# EAGLE design Impedance_Potential (EAGLE 9.6.2)
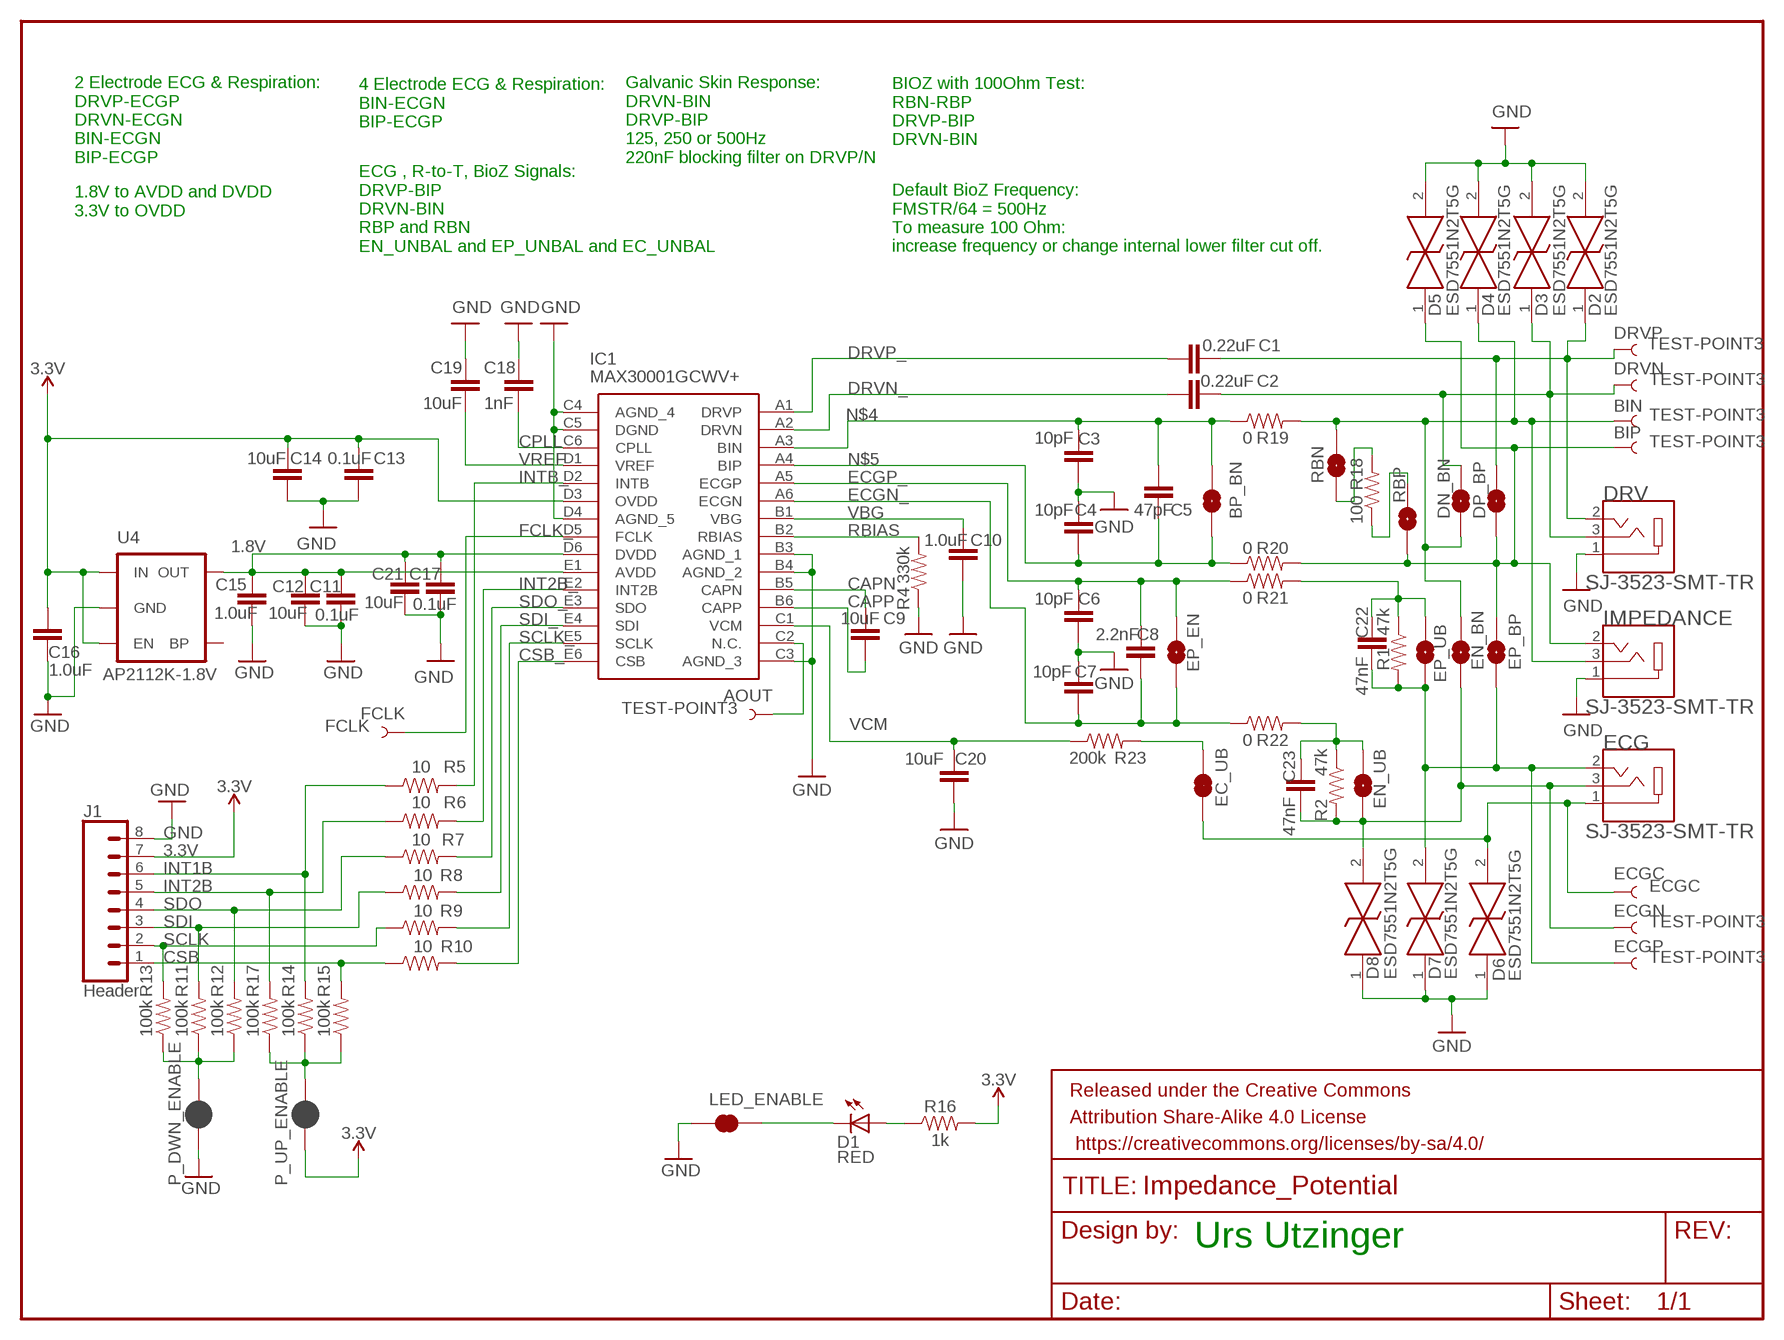
[diagram p0: schematic, sheet 1]

## Parts
AOUT  TEST-POINT3  [PAD.03X.03]
BIN  TEST-POINT3  [PAD.03X.03]
BIP  TEST-POINT3  [PAD.03X.03]
BP_BN  JUMPER-SMT_2_NO_SILK  [SMT-JUMPER_2_NO_SILK]
C1  0.22uF  0.22UF-0603-25V-10%  [0603]
C2  0.22uF  0.22UF-0603-25V-10%  [0603]
C3  10pF  10PF-0603-50V-5%  [0603]
C4  10pF  10PF-0603-50V-5%  [0603]
C5  47pF  47PF-0603-50V-5%  [0603]
C6  10pF  10PF-0603-50V-5%  [0603]
C7  10pF  10PF-0603-50V-5%  [0603]
C8  2.2nF  2.2NF/2200PF-0603-50V-10%  [0603]
C9  10uF  10UF-0603-6.3V-20%  [0603]
C10  1.0uF  1.0UF-0603-16V-10%  [0603]
C11  0.1uF  0.1UF-0603-25V-(+80/-20%)  [0603]
C12  10uF  10UF-0603-6.3V-20%  [0603]
C13  0.1uF  0.1UF-0603-25V-(+80/-20%)  [0603]
C14  10uF  10UF-0603-6.3V-20%  [0603]
C15  1.0uF  1.0UF-0603-16V-10%  [0603]
C16  1.0uF  1.0UF-0603-16V-10%  [0603]
C17  0.1uF  0.1UF-0603-25V-(+80/-20%)  [0603]
C18  1nF  1.0NF/1000PF-0603-50V-10%  [0603]
C19  10uF  10UF-0603-6.3V-20%  [0603]
C20  10uF  10UF-0603-6.3V-20%  [0603]
C21  10uF  10UF-0603-6.3V-20%  [0603]
C22  47nF  47NF-0603-25V-5%  [0603]
C23  47nF  47NF-0603-25V-5%  [0603]
D1  RED  LED-RED0603  [LED-0603]
D2  ESD7551N2T5G  [ESD7551N2T5G]
D3  ESD7551N2T5G  [ESD7551N2T5G]
D4  ESD7551N2T5G  [ESD7551N2T5G]
D5  ESD7551N2T5G  [ESD7551N2T5G]
D6  ESD7551N2T5G  [ESD7551N2T5G]
D7  ESD7551N2T5G  [ESD7551N2T5G]
D8  ESD7551N2T5G  [ESD7551N2T5G]
DN_BN  JUMPER-SMT_2_NO_SILK  [SMT-JUMPER_2_NO_SILK]
DP_BP  JUMPER-SMT_2_NO_SILK  [SMT-JUMPER_2_NO_SILK]
DRV  SJ-3523-SMT-TR  [CUI_SJ-3523-SMT-TR]
DRVN  TEST-POINT3  [PAD.03X.03]
DRVP  TEST-POINT3  [PAD.03X.03]
EC_UB  JUMPER-SMT_2_NC_TRACE_SILK  [SMT-JUMPER_2_NC_TRACE_SILK]
ECG  SJ-3523-SMT-TR  [CUI_SJ-3523-SMT-TR]
ECGC  ECGC  TEST-POINT3  [PAD.03X.03]
ECGN  TEST-POINT3  [PAD.03X.03]
ECGP  TEST-POINT3  [PAD.03X.03]
EN_BN  JUMPER-SMT_2_NO_SILK  [SMT-JUMPER_2_NO_SILK]
EN_UB  JUMPER-SMT_2_NO_SILK  [SMT-JUMPER_2_NO_SILK]
EP_BP  JUMPER-SMT_2_NO_SILK  [SMT-JUMPER_2_NO_SILK]
EP_EN  JUMPER-SMT_2_NO_SILK  [SMT-JUMPER_2_NO_SILK]
EP_UB  JUMPER-SMT_2_NO_SILK  [SMT-JUMPER_2_NO_SILK]
FCLK  FCLK  TEST-POINT3  [PAD.03X.03]
FRAME1  FRAME-LETTERNO_PACKAGE  [DUMMY]
IC1  MAX30001GCWV+  [BGA30C50P6X5_293X274X69]
IMPEDANCE  SJ-3523-SMT-TR  [CUI_SJ-3523-SMT-TR]
J1  Header  CONN_08"  [1X08]
LED_ENABLE  LED ENABLE  JUMPER-SMT_2_NC_TRACE_SILK  [SMT-JUMPER_2_NC_TRACE_SILK]
P_DWN_ENABLE  JUMPER-SMT_2_NC_PASTE_SILK  [SMT-JUMPER_2_NC_PASTE_SILK]
P_UP_ENABLE  JUMPER-SMT_2_NC_PASTE_SILK  [SMT-JUMPER_2_NC_PASTE_SILK]
R1  47k  47KOHM-0603-1/10W-1%  [0603]
R2  47k  47KOHM-0603-1/10W-1%  [0603]
R4  330k  330KOHM-0603-1/10W-1%  [0603]
R5  10  10OHM-0603-1/10W-1%  [0603]
R6  10  10OHM-0603-1/10W-1%  [0603]
R7  10  10OHM-0603-1/10W-1%  [0603]
R8  10  10OHM-0603-1/10W-1%  [0603]
R9  10  10OHM-0603-1/10W-1%  [0603]
R10  10  10OHM-0603-1/10W-1%  [0603]
R11  100k  100KOHM-0603-1/10W-1%  [0603]
R12  100k  100KOHM-0603-1/10W-1%  [0603]
R13  100k  100KOHM-0603-1/10W-1%  [0603]
R14  100k  100KOHM-0603-1/10W-1%  [0603]
R15  100k  100KOHM-0603-1/10W-1%  [0603]
R16  1k  1KOHM-0603-1/10W-1%  [0603]
R17  100k  100KOHM-0603-1/10W-1%  [0603]
R18  100  100OHM-0603-1/10W-1%  [0603]
R19  0  0OHM-0603-1/10W  [0603]
R20  0  0OHM-0603-1/10W  [0603]
R21  0  0OHM-0603-1/10W  [0603]
R22  0  0OHM-0603-1/10W  [0603]
R23  200k  200KOHM-0603-1/10W-1%  [0603]
RBN  JUMPER-SMT_2_NO_SILK  [SMT-JUMPER_2_NO_SILK]
RBP  JUMPER-SMT_2_NO_SILK  [SMT-JUMPER_2_NO_SILK]
U4  AP2112K-1.8V  AP2122K-1.8TRG1SMD  [SPARKFUN-POWERIC_SOT23-5]

## Nets
1.8V: C11.1 C12.1 C15.2 C17.1 C21.1 IC1.D6(DVDD) IC1.E1(AVDD) U4.5(OUT)
3.3V: C13.1 C14.1 C16.2 IC1.D3(OVDD) J1.7 P_UP_ENABLE.1 R16.2 U4.1(IN) U4.3(EN)
AOUT: AOUT.P$1 IC1.C2(N.C.)
BIN: BIN.P$1 D4.1 DN_BN.1 EN_BN.2 IMPEDANCE.3 R19.2 RBN.2
BIP: BIP.P$1 D5.1 DP_BP.1 EP_BP.2 IMPEDANCE.2 R20.2 RBP.1
CAPN: C9.1 IC1.B5(CAPN)
CAPP: C9.2 IC1.B6(CAPP)
CPLL: C18.2 IC1.C6(CPLL)
CSB: J1.1 R10.1 R15.2
CSB_: IC1.E6(CSB) R10.2
DRVN: C2.2 D3.1 DN_BN.2 DRV.3 DRVN.P$1
DRVN_: C2.1 IC1.A2(DRVN)
DRVP: C1.2 D2.1 DP_BP.2 DRV.2 DRVP.P$1
DRVP_: C1.1 IC1.A1(DRVP)
ECGC: D6.2 EC_UB.1 ECG.1 ECGC.P$1
ECGN: C23.2 D8.2 ECG.3 ECGN.P$1 EN_BN.1 EN_UB.1 R2.2
ECGN_: C7.2 C8.2 EP_EN.1 IC1.A6(ECGN) R22.1
ECGP: C22.2 D7.2 ECG.2 ECGP.P$1 EP_BP.1 EP_UB.1 R1.2
ECGP_: C6.1 C8.1 EP_EN.2 IC1.A5(ECGP) R21.1
FCLK_: FCLK.P$1 IC1.D5(FCLK)
GND: C3.2 C4.1 C6.2 C7.1 C10.2 C11.2 C12.2 C13.2 C14.2 C15.1 C16.1 C17.2 C18.1 C19.1 C20.2 C21.2 D2.2 D3.2 D4.2 D5.2 D6.1 D7.1 D8.1 DRV.1 IC1.B3(AGND_1) IC1.B4(AGND_2) IC1.C3(AGND_3) IC1.C4(AGND_4) IC1.C5(DGND) IC1.D4(AGND_5) IMPEDANCE.1 J1.8 LED_ENABLE.1 P_DWN_ENABLE.1 R4.1 U4.2(GND)
INT1B: J1.6 R5.1 R14.2
INT2B: J1.5 R6.1 R17.2
INT2B_: IC1.E2(INT2B) R6.2
INTB_: IC1.D2(INTB) R5.2
N$1: C23.1 EN_UB.2 R2.1 R22.2
N$2: EC_UB.2 R23.2
N$3: C22.1 EP_UB.2 R1.1 R21.2
N$4: BP_BN.2 C3.1 C5.1 IC1.A3(BIN) R19.1
N$5: BP_BN.1 C4.2 C5.2 IC1.A4(BIP) R20.1
N$26: D1.A R16.1
N$28: D1.C LED_ENABLE.2
N$29: P_DWN_ENABLE.2 R11.1 R12.1 R13.1
N$30: P_UP_ENABLE.2 R14.1 R15.1 R17.1
N$32: R18.2 RBN.1
N$33: R18.1 RBP.2
RBIAS: IC1.B2(RBIAS) R4.2
SCLK: J1.2 R9.1 R13.2
SCLK_: IC1.E5(SCLK) R9.2
SDI: J1.3 R8.1 R11.2
SDI_: IC1.E4(SDI) R8.2
SDO: J1.4 R7.1 R12.2
SDO_: IC1.E3(SDO) R7.2
VBG: C10.1 IC1.B1(VBG)
VCM: C20.1 IC1.C1(VCM) R23.1
VREF: C19.2 IC1.D1(VREF)
Unconnected: U4.4(BP)

## Notes on the sheet
- 4 Electrode ECG & Respiration:
  BIN-ECGN
  BIP-ECGP
- BIOZ with 100Ohm Test:
  RBN-RBP
  DRVP-BIP
  DRVN-BIN
- 2 Electrode ECG & Respiration:
  DRVP-ECGP
  DRVN-ECGN
  BIN-ECGN
  BIP-ECGP
- Galvanic Skin Response:
  DRVN-BIN
  DRVP-BIP
  125, 250 or 500Hz
  220nF blocking filter on DRVP/N
- 1.8V to AVDD and DVDD
  3.3V to OVDD
- ECG , R-to-T, BioZ Signals:
  DRVP-BIP
  DRVN-BIN
  RBP and RBN
  EN_UNBAL and EP_UNBAL and EC_UNBAL
- Default BioZ Frequency: 
  FMSTR/64 = 500Hz
  To measure 100 Ohm:
  increase frequency or change internal lower filter cut off.
- Urs Utzinger

## Library data of the parts
AOUT BIN BIP DRVN DRVP ECGC ECGN ECGP FCLK = SparkFun-Connectors:TEST-POINT: SparkFun Test Points Bare copper test points for troubleshooting or In-Circuit-Testing. These are used by our Production team for verifying production board runs using pogo-pins on test beds. SparkFun Products: SparkFun LSM9DS1 Breakout <https://www.sparkfun.com/products/13284> SparkFun PSOC <https://www.sparkfun.com/products/13714> SparkFun Load Cell Amplifier <https://www.sparkfun.com/products/13879>
BP_BN DN_BN DP_BP EN_BN EN_UB EP_BP EP_EN EP_UB RBN RBP = SparkFun-Jumpers:JUMPER-SMT_2_NO: Normally open jumper This jumper has two pads in close proximity to each other. Apply solder to close the connection. Round pads are easier to solder for beginners, but are a lot larger. SparkFun Product that uses the round pads: SparkFun EL Sequencer <https://www.sparkfun.com/products/12781>
C1 C2 = SparkFun-Capacitors:0.22UF: 0.22µF ceramic capacitors A capacitor is a passive two-terminal electrical component used to store electrical energy temporarily in an electric field.; PROD_ID: CAP-07822
C3 C4 C6 C7 = SparkFun-Capacitors:10PF: 10pF ceramic capacitors A capacitor is a passive two-terminal electrical component used to store electrical energy temporarily in an electric field.; PROD_ID: CAP-11812
C5 = SparkFun-Capacitors:47PF: 47pF ceramic capacitors A capacitor is a passive two-terminal electrical component used to store electrical energy temporarily in an electric field.; PROD_ID: CAP-08913
C8 = SparkFun-Capacitors:2.2NF/2200PF: 2.2nF/2,200pF ceramic capacitors A capacitor is a passive two-terminal electrical component used to store electrical energy temporarily in an electric field.; PROD_ID: CAP-07877
C9 C12 C14 C19-C21 = SparkFun-Capacitors:10UF: 10.0µF ceramic capacitors A capacitor is a passive two-terminal electrical component used to store electrical energy temporarily in an electric field.; PROD_ID: CAP-11015
C10 C15 C16 = SparkFun-Capacitors:1.0UF: 1µF ceramic capacitors A capacitor is a passive two-terminal electrical component used to store electrical energy temporarily in an electric field.; PROD_ID: CAP-00868
C11 C13 C17 = SparkFun-Capacitors:0.1UF: 0.1µF ceramic capacitors A capacitor is a passive two-terminal electrical component used to store electrical energy temporarily in an electric field.; PROD_ID: CAP-00810
C18 = SparkFun-Capacitors:1.0NF/1000PF: 1nF/1,000pF ceramic capacitors A capacitor is a passive two-terminal electrical component used to store electrical energy temporarily in an electric field.; PROD_ID: CAP-07886
C22 C23 = SparkFun-Capacitors:47NF: 47nF ceramic capacitors A capacitor is a passive two-terminal electrical component used to store electrical energy temporarily in an electric field.; PROD_ID: CAP-08605
D1 = SparkFun-LED:LED-RED: Assorted Red LEDs LilyPad 1206- DIO-09912 1206- DIO-00809 0603- DIO-00819; PROD_ID: DIO-00819
D2-D8 = ESD7551N2T5G:ESD7551N2T5G: ESD Suppressors / TVS Diodes BI-DIRECTIONAL 5V ESD PR Source: Datasheet <http://www.onsemi.com/pub/Collateral/ESD7551-D.PDF>; DESCRIPTION: ESD Suppressors / TVS Diodes BI-DIRECTIONAL 5V ESD PR; HEIGHT: 0.4mm; MANUFACTURER_NAME: onsemi; MANUFACTURER_PART_NUMBER: ESD7551N2T5G; MOUSER_PART_NUMBER: 863-ESD7551N2T5G; MOUSER_PRICE-STOCK: https://www.mouser.co.uk/ProductDetail/onsemi/ESD7551N2T5G?qs=5aG0NVq1C4x8NutXGbtG6w%3D%3D
DRV ECG IMPEDANCE = SJ-3523-SMT-TR:SJ-3523-SMT-TR: Audio Jack Connector 3.5 mm Low Profile Surface Mount Stereo Jack, 3 Pin Right-Angle Check availability <https://pricing.snapeda.com/parts/SJ-3523-SMT-TR/CUI%20Devices/view-part?ref=eda>; AVAILABILITY: In Stock; CUI_PURCHASE_URL: https://www.cuidevices.com/product/interconnect/connectors/audio-connectors/jacks/sj-352x-smt-series?utm_source=snapeda.com&utm_medium=referral&utm_campaign=snapedaBOM; DESCRIPTION: 3.5 mm, Stereo, Right Angle, Surface Mount (SMT), 3 Conductors, 0~1 Internal Switches, Audio Jack Connector; MF: CUI Devices; MP: SJ-3523-SMT-TR; PACKAGE: None; PRICE: None; PURCHASE-URL: https://pricing.snapeda.com/search/part/SJ-3523-SMT-TR/?ref=eda
EC_UB LED_ENABLE = SparkFun-Jumpers:JUMPER-SMT_2_NC_TRACE: Normally closed trace jumper This jumper has a trace between two pads so it's normally closed (NC). Use a razor knife to open the connection. For best results follow the IPC guidelines for cutting traces: Cutout at least 0.063 mm (0.005 in). Remove all loose material to clean up the cut area. Seal the cut with an approved epoxy. Reapply solder to reclose the connection.
FRAME1 = SparkFun-Aesthetics:FRAME-LETTER: Schematic Frame - Letter Standard 8.5x11 US Letter frame; DESIGNER: Nobody; VERSION: v01
IC1 = MAX30001GCWV+:MAX30001GCWV+: MAXIM INTEGRATED / ANALOG DEVICES - MAX30001GCWV+ - 1 LEAD ECG & BIOZ AFE Source: Datasheet <https://datasheets.maximintegrated.com/en/ds/MAX30001G.pdf>; DESCRIPTION: MAXIM INTEGRATED / ANALOG DEVICES - MAX30001GCWV+ - 1 LEAD ECG & BIOZ AFE; HEIGHT: 0.69mm; MANUFACTURER_NAME: Analog Devices; MANUFACTURER_PART_NUMBER: MAX30001GCWV+; MOUSER_PART_NUMBER: 700-MAX30001GCWV+; MOUSER_PRICE-STOCK: https://www.mouser.co.uk/ProductDetail/Analog-Devices-Maxim-Integrated/MAX30001GCWV%2b?qs=Rp5uXu7WBW%2FLfomdQH9F5g%3D%3D
J1 = SparkFun-Connectors:CONN_08: Multi connection point. Often used as Generic Header-pin footprint for 0.1 inch spaced/style header connections On any of the 0.1 inch spaced packages, you can populate with these: Break Away Headers - Straight <https://www.sparkfun.com/products/116> (PRT-00116) Break Away Male Headers - Right Angle <https://www.sparkfun.com/products/553> (PRT-00553) Female Headers <https://www.sparkfun.com/products/115> (PRT-00115) Break Away Headers - Machine Pin <https://www.sparkfun.com/products/117> (PRT-00117) Break Away Female Headers - Swiss Machine Pin <https://www.sparkfun.com/products/743> (PRT-00743) Arduino Stackable Header - 8 Pin <https://www.sparkfun.com/products/9279> (PRT-09279) For SCREWTERMINALS and SPRING TERMINALS visit here: Screw Terimnals on SparkFun.com <https://www.sparkfun.com/search/results?term=Screw+Terminals> (5mm/3.5mm/2.54mm spacing) This device is also useful as a general connection point to wire up your design to another part of your project. Our various solder wires solder well into these plated through hole pads. Hook-Up Wire - Assortment (Stranded, 22 AWG) <https://www.sparkfun.com/products/11375> (PRT-11375) Hook-Up Wire - Assortment (Solid Core, 22 AWG) <https://www.sparkfun.com/products/11367> (PRT-11367) View the entire wire category on our website here <https://www.sparkfun.com/categories/141> Special notes: Molex polarized connector foot print use with SKU : PRT-08231 with associated crimp pins and housings. 1MM SMD Version SKU: PRT-10208 NOTES ON THE VARIANTS LOCK and LOCK_LONGPADS... This footprint was designed to help hold the alignment of a through-hole component (i.e. 6-pin header) while soldering it into place. You may notice that each hole has been shifted either up or down by 0.005 of an inch from it's more standard position (which is a perfectly straight line). This slight alteration caused the pins (the squares in the middle) to touch the edges of the holes. Because they are alternating, it causes a "brace" to hold the component in place. 0.005 has proven to be the perfect amount of "off-center" position when using our standard breakaway headers. Although looks a little odd when you look at the bare footprint, once you have a header in there, the alteration is very hard to notice. Also,if you push a header all the way into place, it is covered up entirely on the bottom side.; PROD_ID: CONN-08438
P_DWN_ENABLE P_UP_ENABLE = SparkFun-Jumpers:JUMPER-SMT_2_NC_PASTE: Normally closed solder jumper This jumper has an aperture in the stencil to allow solder paste to bridge the split in the wire so it's normally closed (NC). Wick off the solder to open the connection. Reapply solder to reclose the connection.
R1 R2 = SparkFun-Resistors:47KOHM: 47kΩ resistor A resistor is a passive two-terminal electrical component that implements electrical resistance as a circuit element. Resistors act to reduce current flow, and, at the same time, act to lower voltage levels within circuits. - Wikipedia; PROD_ID: RES-07871
R4 = SparkFun-Resistors:330KOHM: 330kΩ resistor A resistor is a passive two-terminal electrical component that implements electrical resistance as a circuit element. Resistors act to reduce current flow, and, at the same time, act to lower voltage levels within circuits. - Wikipedia; PROD_ID: RES-08968
R5-R10 = SparkFun-Resistors:10OHM: 10Ω resistor A resistor is a passive two-terminal electrical component that implements electrical resistance as a circuit element. Resistors act to reduce current flow, and, at the same time, act to lower voltage levels within circuits. - Wikipedia; PROD_ID: RES-12581
R11-R15 R17 = SparkFun-Resistors:100KOHM: 100kΩ resistor A resistor is a passive two-terminal electrical component that implements electrical resistance as a circuit element. Resistors act to reduce current flow, and, at the same time, act to lower voltage levels within circuits. - Wikipedia; PROD_ID: RES-07828
R16 = SparkFun-Resistors:1KOHM: 1kΩ resistor A resistor is a passive two-terminal electrical component that implements electrical resistance as a circuit element. Resistors act to reduce current flow, and, at the same time, act to lower voltage levels within circuits. - Wikipedia; PROD_ID: RES-07856
R18 = SparkFun-Resistors:100OHM: 100Ω resistor A resistor is a passive two-terminal electrical component that implements electrical resistance as a circuit element. Resistors act to reduce current flow, and, at the same time, act to lower voltage levels within circuits. - Wikipedia; PROD_ID: RES-07863
R19-R22 = SparkFun-Resistors:0OHM: 0Ω resistor A resistor is a passive two-terminal electrical component that implements electrical resistance as a circuit element. Resistors act to reduce current flow, and, at the same time, act to lower voltage levels within circuits. - Wikipedia; PROD_ID: RES-08609
R23 = SparkFun-Resistors:200KOHM: 200kΩ resistor A resistor is a passive two-terminal electrical component that implements electrical resistance as a circuit element. Resistors act to reduce current flow, and, at the same time, act to lower voltage levels within circuits. - Wikipedia; PROD_ID: RES-09385
U4 = AP2112K-1.8TRG1:AP2122K-1.8TRG1: Voltage Regulator LDO Standard 150mA LDO voltage regulator in SOT-23 layout. Micrel part MIC5205. BP (by-pass) pin is used to lower output noise with 470pF cap.; PROD_ID: VREG-12457

## Board
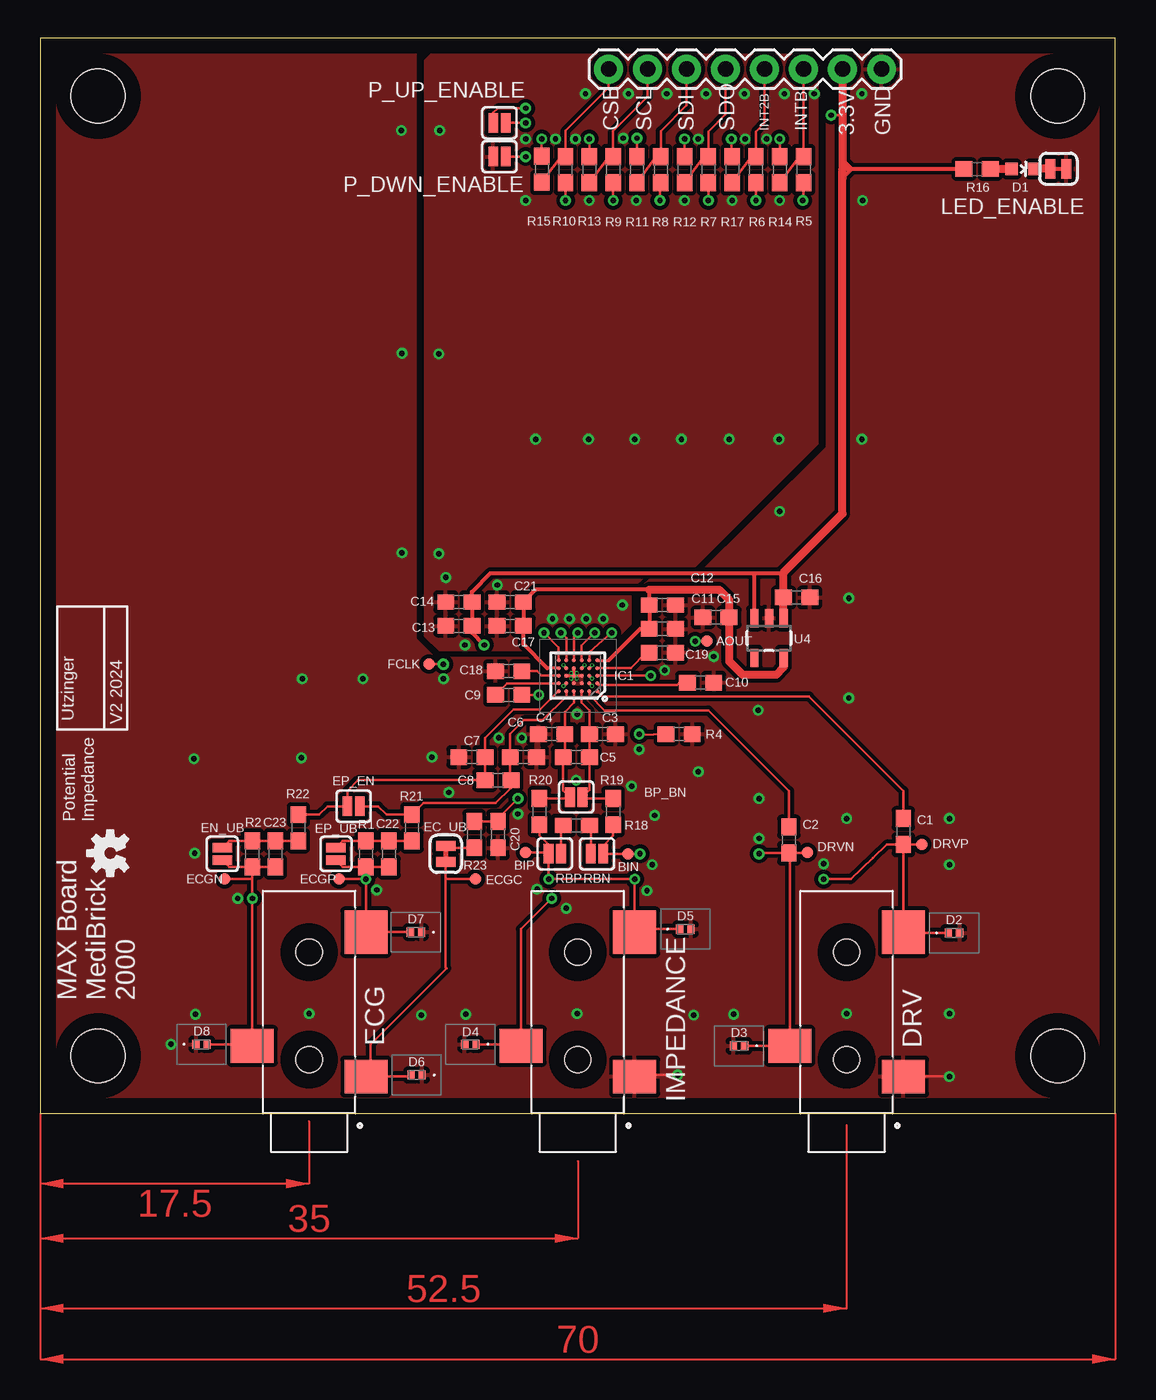
[diagram p1: board, top side]
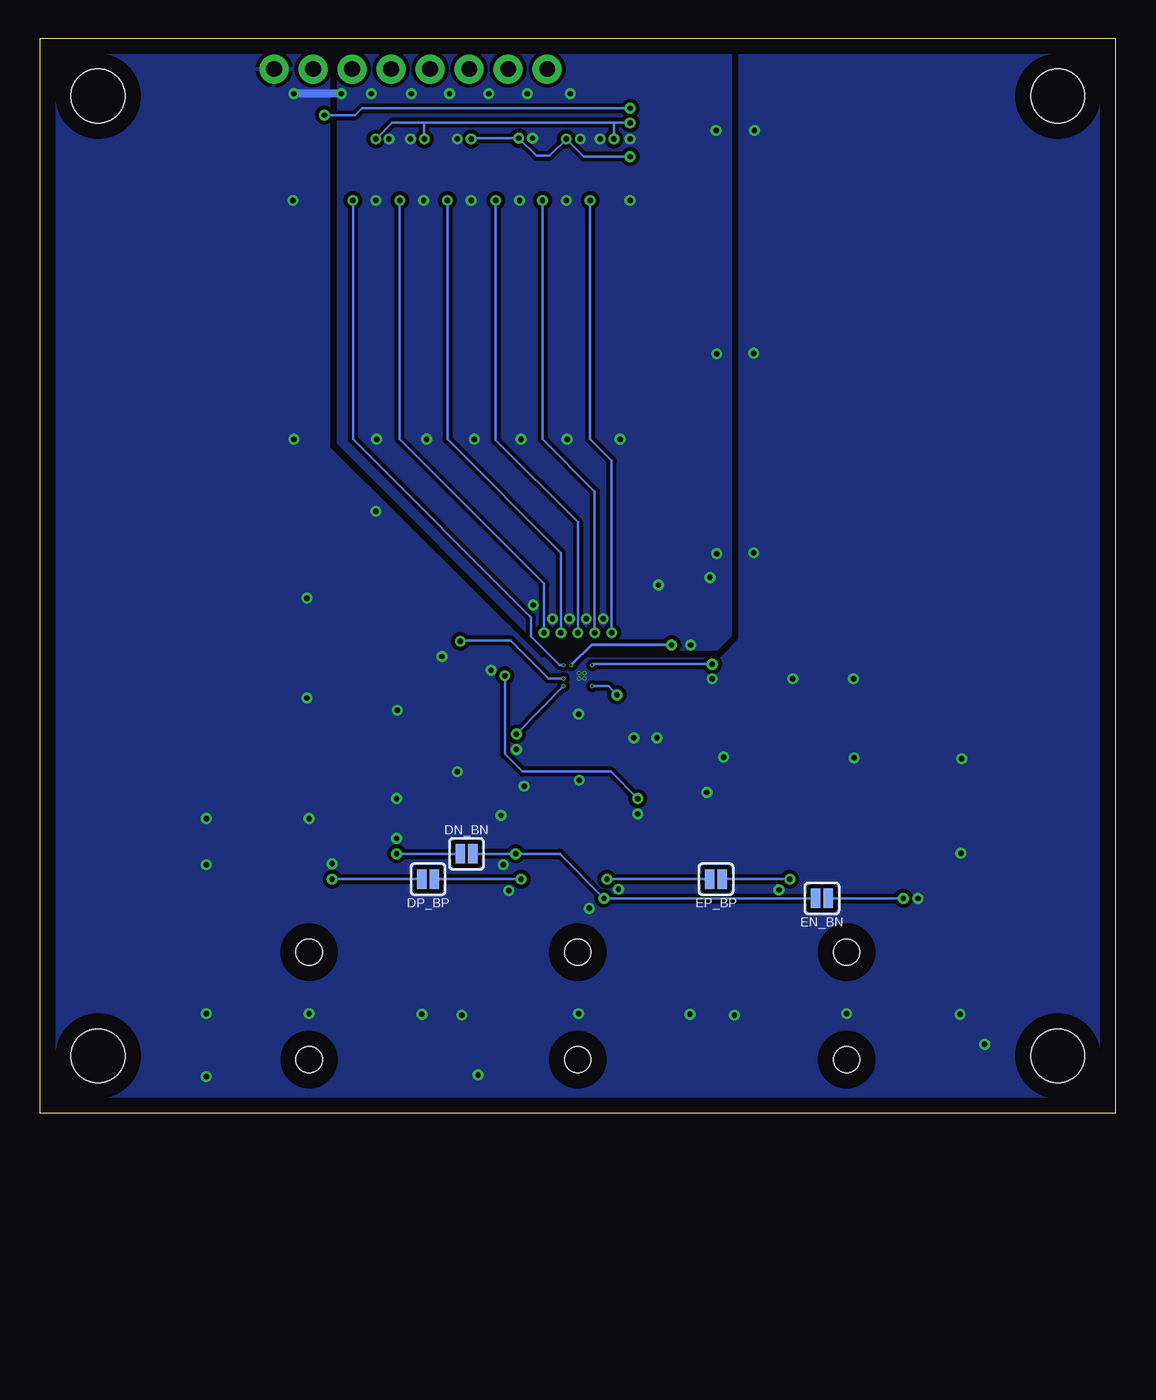
[diagram p2: board, bottom side, seen from below]

Size 70 x 70 mm. Coordinates in mm from the lower left corner, seen from the top.
Outline: 0,0 70,0 70,70 0,70 0,0
Copper layers (1*16): Top 0.035mm / dielectric 1.5mm / Bottom 0.035mm
Design rules "default *": minimum track width 4mil, minimum drill 0.1mm, track to track 6mil, track to pad 3mil, pad to pad 6mil, via to via 3mil, smd to smd 3mil, copper to edge 40mil, drill to drill 6mil, minimum pad ring 3mil, minimum via ring 2mil, stop-mask expansion 3mil, vias tented up to drill 15mil, thermal gap 10mil
Holes 3.5 mm at 3.75,66.25 66.25,66.25 3.75,3.75 66.25,3.75

### Footprints (pad centres in the part's own frame; a part is rotated, then mirrored left to right if it is on the bottom)
PAD.03X.03 = smd 0.762 x 0.762: P$1 0,0
SMT-JUMPER_2_NO_SILK = smd 0.635 x 1.27: 1 -0.406,0; 2 0.406,0
0603 = smd 1.1 x 1: 1 -0.85,0; 2 0.85,0
LED-0603 = smd 0.8 x 0.8: A 0,-0.75; C 0,0.75
ESD7551N2T5G = smd 0.47 x 0.6: 1 -0.365,0; 2 0.365,0
CUI_SJ-3523-SMT-TR = smd 2.2 x 2.8: 1 -1.1,-3.7; 3 0.9,3.7 | smd 2.8 x 2.8: 2 8.3,-3.7 | hole 1.7: 0,0; 7,0
SMT-JUMPER_2_NC_TRACE_SILK = smd 0.66 x 1.27: 1 -0.521,0; 2 0.521,0
BGA30C50P6X5_293X274X69 = smd 0.25 x 0.25: A1 -1.25,1; A2 -0.75,1; A3 -0.25,1; A4 0.25,1; A5 0.75,1; A6 1.25,1; B1 -1.25,0.5; B2 -0.75,0.5; B3 -0.25,0.5; B4 0.25,0.5; B5 0.75,0.5; B6 1.25,0.5; C1 -1.25,0; C2 -0.75,0; C3 -0.25,0; C4 0.25,0; C5 0.75,0; C6 1.25,0; D1 -1.25,-0.5; D2 -0.75,-0.5; D3 -0.25,-0.5; D4 0.25,-0.5; D5 0.75,-0.5; D6 1.25,-0.5; E1 -1.25,-1; E2 -0.75,-1; E3 -0.25,-1; E4 0.25,-1; E5 0.75,-1; E6 1.25,-1
1X08 = drill 1.016 pad 1.88: 1 0,0; 2 2.54,0; 3 5.08,0; 4 7.62,0; 5 10.16,0; 6 12.7,0; 7 15.24,0; 8 17.78,0
SMT-JUMPER_2_NC_PASTE_SILK = smd 0.635 x 1.27: 1 -0.406,0; 2 0.406,0
SPARKFUN-POWERIC_SOT23-5 = smd 0.55 x 1.2: 1 -0.95,-1.3; 2 0,-1.3; 3 0.95,-1.3; 4 0.95,1.3; 5 -0.95,1.3

### Placement (x,y rotation side)
AOUT  43.4,30.75 0 top
BIN  38.25,16.9 0 top
BIP  31.6,17 0 top
BP_BN  34.9,20.6 0 top
C1  56.2,18.35 270 top
C2  48.75,17.8 270 top
C3  36.6,24.7 0 top
C4  33.3,24.7 0 top
C5  34.9,23.2 180 top
C6  31.45,23.2 0 top
C7  28.1,23.2 0 top
C8  29.8,21.7 180 top
C9  30.5,27.25 180 top
C10  43,28.05 0 top
C11  40.5,31.55 0 top
C12  40.5,33.1 0 top
C13  27.25,31.75 180 top
C14  27.25,33.3 180 top
C15  44,32.3 0 top
C16  49.25,33.6 180 top
C17  30.6,31.75 180 top
C18  30.5,28.8 0 top
C19  40.5,30 180 top
C20  29.8,18.15 270 top
C21  30.6,33.3 180 top
C22  22.7,16.9 270 top
C23  15.3,16.9 270 top
D1  64,61.5 270 top
D2  59.5,11.75 0 top
D3  45.5,4.4 180 top
D4  28,4.5 180 top
D5  42,12 0 top
D6  24.5,2.5 180 top
D7  24.45,11.8 180 top
D8  10.5,4.5 0 top
DN_BN  42.25,16.9 180 bottom
DP_BP  44.75,15.25 180 bottom
DRV  52.5,3.5 90 top
DRVN  49.95,17 0 top
DRVP  57.4,17.5 0 top
EC_UB  26.4,16.9 90 top
ECG  17.5,3.5 90 top
ECGC  28.35,15.25 0 top
ECGN  12,15.25 0 top
ECGP  19.45,15.25 0 top
EN_BN  19.1,14 180 bottom
EN_UB  11.85,16.9 90 top
EP_BP  26,15.25 180 bottom
EP_EN  20.4,20 0 top
EP_UB  19.25,16.9 90 top
FCLK  25.3,29.25 90 top
FRAME1  -10.7,-36.8 0 top  (outside the outline)
IC1  35,28.5 180 top
IMPEDANCE  35,3.5 90 top
J1  37,68 0 top
LED_ENABLE  66.3,61.5 180 top
P_DWN_ENABLE  29.89,62.3 0 top
P_UP_ENABLE  29.89,64.5 0 top
R1  21.2,16.9 270 top
R2  13.8,16.9 270 top
R4  41.6,24.7 180 top
R5  49.7,61.45 270 top
R6  46.6,61.45 270 top
R7  43.5,61.45 270 top
R8  40.4,61.45 270 top
R9  37.3,61.45 270 top
R10  34.2,61.45 270 top
R11  38.85,61.45 270 top
R12  41.95,61.45 270 top
R13  35.75,61.45 270 top
R14  48.15,61.45 270 top
R15  32.65,61.48 270 top
R16  61,61.5 180 top
R17  45.05,61.45 270 top
R18  34.9,18.75 0 top
R19  37.3,19.65 270 top
R20  32.5,19.65 270 top
R21  24.2,18.6 270 top
R22  16.8,18.6 270 top
R23  28.25,18.15 270 top
RBN  36.25,16.9 0 top
RBP  33.5,16.9 0 top
U4  47.45,30.95 180 top
U$1  [OSHW-LOGO-S]  4.55,16.95 90 top

### Tracks (layer width: path | path; a pad name or v marks a point on that pad's centre or on a via)
1.8V
  Top 0.152: IC1.D6
  Top 0.2: IC1.D6 33.5,29 33,29 | IC1.E1 37,29.5
  Top 0.254: 37,29.5 39.05,31.55 C11.1 C12.1 39.65,34.1 32.25,34.1 C21.1 C17.1 31.45,30.55 33,29
  Top 0.508: U4.5 48.4,29.05 47.9,28.55 45.75,28.55 44.85,29.45 C15.2 44.85,33.45 44.2,34.1 40,34.1 39.65,34.1
3.3V  (via drill 0.13 pad 0.25, 0.35 pad 0.7)
  Top 0.152: 52.24,65 v51.5,65 | v31.6,65.45 29.79,65.45 29.49,65.15 P_UP_ENABLE.1
  Top 0.2: IC1.D3 v35.43,29.18
  Top 0.254: v28.9,30.5 28.1,31.3 C13.1 C14.1 28.1,33.95 29.32,35.17 46.5,35.17 | 52.24,61.5 52.83,61.5 | 52.83,61.5 52.84,61.5 | 52.84,61.5 R16.2 | 52.83,61.5 52.24,62.09 | 52.24,60.9 52.84,61.5 | U4.3 46.5,35.17 | 46.5,35.17 48.4,35.17
  Top 0.508: J1.7 52.24,65 52.24,62.09 52.24,61.5 52.24,60.9 52.24,39.05 48.4,35.21 48.4,35.17 C16.2 U4.1
  Bottom 0.152: v51.5,65 49.5,65 49.05,65.45 v31.6,65.45
  Bottom 0.2: 34.11,30.5 v35.43,29.18
  Bottom 0.203: v28.9,30.5 34.11,30.5
AOUT  (via drill 0.13 pad 0.25, 0.35 pad 0.7)
  Top 0.152: AOUT.P$1 v42.65,30.75
  Top 0.2: IC1.C2 v35.93,28.32
  Bottom 0.152: v42.65,30.75 42.62,30.78 39.38,30.78 36.92,28.32 v35.93,28.32
BIN  (via drill 0.35 pad 0.7)
  Top 0.152: D4.1 31.2,4.5 IMPEDANCE.3 31.3,12 v33.3,14 | R19.2 37.3,18.1 36.66,17.46 RBN.2 BIN.P$1 v39.05,16.9
  Bottom 0.152: EN_BN.2 v33.3,14 36.13,16.87 36.17,16.9 v39.05,16.9 DN_BN.1
BIP  (via drill 0.35 pad 0.7)
  Top 0.152: D5.1 38.9,12 IMPEDANCE.2 v38.7,15.25 v33.1,15.25 | v33.1,15.25 33.1,16.79 RBP.1 33.09,17.51 32.5,18.1 R20.2 | v33.1,15.25 33.1,17 BIP.P$1
  Bottom 0.152: v33.1,15.25 EP_BP.2 | DP_BP.1 v38.7,15.25
CAPN  (via drill 0.13 pad 0.25, 0.35 pad 0.7)
  Top 0.152: C9.1 v32.45,27.25
  Top 0.2: IC1.B5 v34.07,27.82
  Bottom 0.152: v32.45,27.25 33.02,27.82 v34.07,27.82
CAPP
  Top 0.152: C9.2 30.4,28 IC1.B6
CPLL
  Top 0.152: C18.2 32.35,28.8 32.65,28.5 IC1.C6
CSB
  Top 0.152: J1.1 36.99,66.79 34.2,64 R10.1 33.8,62.17 R15.2
CSB_  (via drill 0.35 pad 0.7)
  Top 0.152: IC1.E6 33.75,30.35 v32.8,31.3 | R10.2 v34.2,59.45
  Bottom 0.152: v32.8,31.3 32.8,42.5 34.2,43.9 v34.2,59.45
DRVN  (via drill 0.35 pad 0.7)
  Top 0.152: C2.2 46.85,16.95 v46.8,16.9 | D3.1 DRV.3 48.8,16.9 C2.2 | DRVN.P$1 49.9,16.95 C2.2
  Bottom 0.152: v46.8,16.9 DN_BN.2
DRVN_
  Top 0.152: IC1.A2 35.75,27.25 36.75,26.25 43.5,26.25 48.75,21 C2.1
DRVP  (via drill 0.35 pad 0.7)
  Top 0.152: D2.1 56.25,11.75 DRV.2 C1.2 | C1.2 55.12,17.5 54.21,16.63 52.77,15.25 v51,15.25 | DRVP.P$1 C1.2
  Bottom 0.152: v51,15.25 DP_BP.2
DRVP_
  Top 0.152: C1.1 56.2,21 50.05,27.15 36.6,27.15 IC1.A1
ECGC
  Top 0.152: D6.2 24.04,2.4 ECG.1 21.5,2.7 21.5,4.5 26.45,9.45 26.4,9.5 26.4,15.25 | EC_UB.1 26.4,15.3 26.4,15.25 | ECGC.P$1 26.4,15.25
ECGN  (via drill 0.35 pad 0.7)
  Top 0.152: EN_UB.1 12.3,16.05 12.31,16.05 R2.2 | C23.2 R2.2 | 13.8,15.25 v13.8,14 ECG.3 13.7,4.5 D8.2 | ECGN.P$1 13.8,15.25 | 13.8,15.25 R2.2
  Bottom 0.152: EN_BN.1 v13.8,14
ECGN_
  Top 0.152: R22.1 18.15,19.45 18.7,20 EP_EN.1 19.99,21 20.69,21.7 C8.2 C7.2 28.95,24.45 30.8,26.3 32.55,26.3 IC1.A6
ECGP  (via drill 0.35 pad 0.7)
  Top 0.152: D7.2 ECG.2 v21.2,15.25 | ECGP.P$1 v21.2,15.25 | v21.2,15.25 R1.2 | C22.2 R1.2 | R1.2 19.69,16.05 EP_UB.1
  Bottom 0.152: EP_BP.1 v21.2,15.25
ECGP_
  Top 0.152: EP_EN.2 22,20 22.55,19.45 R21.1 24.95,20.2 29.65,20.2 30.65,21.2 C8.1 30.6,21.75 C6.1 30.6,24.7 31.5,25.6 32.7,25.6 34.25,27.15 IC1.A5
FCLK_  (via drill 0.13 pad 0.25, 0.35 pad 0.75)
  Top 0.152: v26.25,29.25 FCLK.P$1
  Top 0.2: IC1.D5 v34.07,29.18
  Bottom 0.152: v34.07,29.18 34,29.25 v26.25,29.25
GND  (via drill 0.13 pad 0.25, 0.35 pad 0.7)
  Top 0.152: v34.57,28.32 IC1.C4 | v34.93,28.32 IC1.C4 | v34.93,28.68 IC1.C4 | IC1.C4 v34.57,28.68 | DRV.1 v59.2,2.4 | IMPEDANCE.1 38.8,2.5 v41.5,2.5
  Top 0.2: IC1.C5 IC1.C4 | IC1.C4 IC1.D4 | IC1.C4 IC1.C3
  Bottom 0.508: v50.4,66.4 v53.5,66.4
  other vias: 17.5,6.5 34.95,6.5 52.5,6.5 40,19.4 8.5,4.5 52.5,19.2 23.55,49.5 17.05,28.3 10.05,16.95 26,64 31.6,59.45 53.55,59.45 46.75,26.25 59.2,16.2 59.2,6.5 48.45,66.4 45.85,66.4 43.35,66.4 40.8,66.4 38.3,66.4 35.5,66.4 25.95,49.45 43.85,29.75 48.1,43.9 26.4,34.9 44.85,43.9 37.9,33.1 23.5,64 35.75,59.45 38.8,59.45 45.05,59.45 48.15,59.45 32.25,43.9 21,28.3 10,23.1 17,23.15 25.5,23.2 39.5,14.5 12.85,14 10.1,6.45 24.8,6.4 27.7,6.45 42.55,6.4 45.15,6.45 41.95,59.45 33.55,63.45 34.85,63.45 31.6,63.45 37.95,63.5 42.85,63.45 47.3,63.45 26.25,28.3 40.65,28.85 35.7,43.9 38.7,43.9 41.75,43.9 59.2,19.2 46.8,20.5 42.85,22.25 45.9,63.45 36.65,32.2 35.55,32.2 34.45,32.2 33.35,32.2 26.6,20.9 34.25,13.35 31.1,19.5 38.5,21.3 21.9,14.55 51,16.25 46.8,17.9 39.85,16.2 32.35,14.6 39,23.7 25.95,36.45 23.55,36.5 53.5,43.9 52.65,33.55 52.65,27.05 27.65,30.5 48.15,39.2 29.75,34.4 31.35,24.45 29.85,24.45 34.95,26 34.9,21.7
  pour Top (isolate 0.254): 0,70 0,0 70,0 70,70 51.15,70 51.15,43.35 42.5,34.75 39.63,34.75 38.8,33.99 38.8,31.7 36.8,29.7 25.7,29.7 24.5,30.9 24.5,70
  pour Bottom (isolate 0.254): 24.5,70 1,70 0,69 0,0 70,0 70,70 51.15,70 51.15,43.35 37.4,29.7 25.68,29.7 24.5,30.9
  pour Bottom (isolate 0.254): 25,70 25,31.1 25.95,30.15 37.2,30.15 50.65,43.6 50.65,69.85 50.5,70
  pour Top (isolate 0.254): 50.65,70 26.45,70 25,68.55 25,31.1 25.95,30.15 36.8,30.15 38.5,31.85 38.5,34.1 39.5,35.1 42.15,35.1 50.65,43.6
INT1B
  Top 0.152: J1.6 R5.1 49.3,62.15 R14.2
INT2B
  Top 0.152: J1.5 47.16,64.5 46.6,63.94 R6.1 46.21,62.16 R17.2
INT2B_  (via drill 0.35 pad 0.7)
  Top 0.152: IC1.E2 35.75,30.06 v37.2,31.3 | R6.2 v46.6,59.45
  Bottom 0.152: v37.2,31.3 37.2,34.5 46.6,43.9 v46.6,59.45
INTB_  (via drill 0.13 pad 0.25, 0.35 pad 0.7)
  Top 0.152: v49.65,59.45 49.7,59.59 R5.2
  Top 0.2: IC1.D2 v35.93,29.18
  Bottom 0.152: v49.65,59.45 49.65,43.9 38.05,32.3 38.05,31.05 36.2,29.2 35.95,29.2 v35.93,29.18
N$1
  Top 0.152: EN_UB.2 12.29,17.75 R2.1 C23.1 R22.2
N$2
  Top 0.152: EC_UB.2 26.4,17.3 R23.2
N$3
  Top 0.152: R21.2 C22.1 R1.1 19.69,17.75 EP_UB.2
N$4
  Top 0.152: R19.1 35.41,20.5 BP_BN.2 35.75,21.04 C5.1 C3.1 35.75,26.25 35.25,26.75 IC1.A3
N$5
  Top 0.152: R20.1 34.39,20.5 BP_BN.1 34.05,21.04 C5.2 34.15,23.3 C4.2 34.15,26.15 34.75,26.75 IC1.A4
N$26
  Top 0.508: R16.1 D1.A
N$28
  Top 0.508: LED_ENABLE.2 D1.C
N$29  (via drill 0.35 pad 0.7)
  Top 0.152: v31.6,62.3 P_DWN_ENABLE.2 | R13.1 35.77,62.32 v35.75,63.45 | v38.85,63.5 R11.1 | R12.1 41.97,62.32 v41.95,63.45
  Bottom 0.152: v31.6,62.3 34.6,62.3 v35.75,63.45 36.85,62.35 37.7,62.35 v38.85,63.5 41.9,63.5 v41.95,63.45
N$30  (via drill 0.35 pad 0.7)
  Top 0.152: R15.1 v32.65,63.45 | R17.1 45,62.31 v45,63.45 | v48.15,63.45 R14.1 | v31.6,64.5 P_UP_ENABLE.2
  Bottom 0.152: v32.65,63.45 32.65,64.5 | 32.65,64.5 45,64.5 | v45,63.45 45,64.5 | v31.6,64.5 32.65,64.5 | 45,64.5 47.1,64.5 v48.15,63.45
N$32
  Top 0.152: R18.2 35.84,18.66 RBN.1
N$33
  Top 0.152: RBP.2 33.91,18.61 R18.1
RBIAS  (via drill 0.13 pad 0.25, 0.35 pad 0.7)
  Top 0.152: v39,24.7 39.1,24.65 R4.2
  Top 0.2: IC1.B2 v35.93,27.82
  Bottom 0.152: v39,24.7 v35.93,27.82
SCLK
  Top 0.152: J1.2 39.54,66.2 37.3,63.96 R9.1 36.89,62.14 R13.2
SCLK_  (via drill 0.35 pad 0.7)
  Top 0.152: IC1.E5 34.25,30.95 v33.9,31.3 | R9.2 37.3,59.56 37.34,59.55 37.3,59.51 v37.3,59.45
  Bottom 0.152: v37.3,59.45 37.3,43.9 33.9,40.5 v33.9,31.3
SDI
  Top 0.152: J1.3 42.08,65.65 40.4,63.97 R8.1 40,62.3 40,62.17 R11.2
SDI_  (via drill 0.35 pad 0.7)
  Top 0.152: R8.2 40.35,60.6 v40.35,59.45 | IC1.E4 34.75,31.05 v35,31.3
  Bottom 0.152: v35,31.3 35,38.5 40.35,43.85 v40.35,59.45
SDO
  Top 0.152: J1.4 44.62,65.05 43.5,63.93 R7.1 43.12,62.17 R12.2
SDO_  (via drill 0.35 pad 0.7)
  Top 0.152: IC1.E3 35.25,30.45 v36.1,31.3 | R7.2 v43.5,59.45
  Bottom 0.152: v36.1,31.3 36.1,36.5 43.5,43.9 v43.5,59.45
VBG
  Top 0.152: IC1.B1 36.35,27.9 41.47,27.9 41.62,28.05 C10.1
VCM  (via drill 0.35 pad 0.7)
  Top 0.152: IC1.C1 v39.75,28.5 | v31.1,20.5 29.8,19.2 C20.1 R23.1
  Bottom 0.152: v39.75,28.5 39.75,23.4 38.6,22.25 32.85,22.25 v31.1,20.5
VREF
  Top 0.152: C19.2 39.45,30 38.45,29 IC1.D1
(copper drawn outside any net)
  shapes: Top area x4

### Text on the board
tPlace: AOUT | FCLK | Potential / Impedance | DRVN | DRVP | BIP | BIN | ECGN | ECGP | ECGC
tNames: CSB | SCL | SDI | SDO | INT2B | INTB | 3.3V | GND | Utzinger | V2 2024 | MAX Board / MediBrick / 2000